# EAGLE schematic MAX30208_HSP3_DEMO_B (EAGLE 6.0)
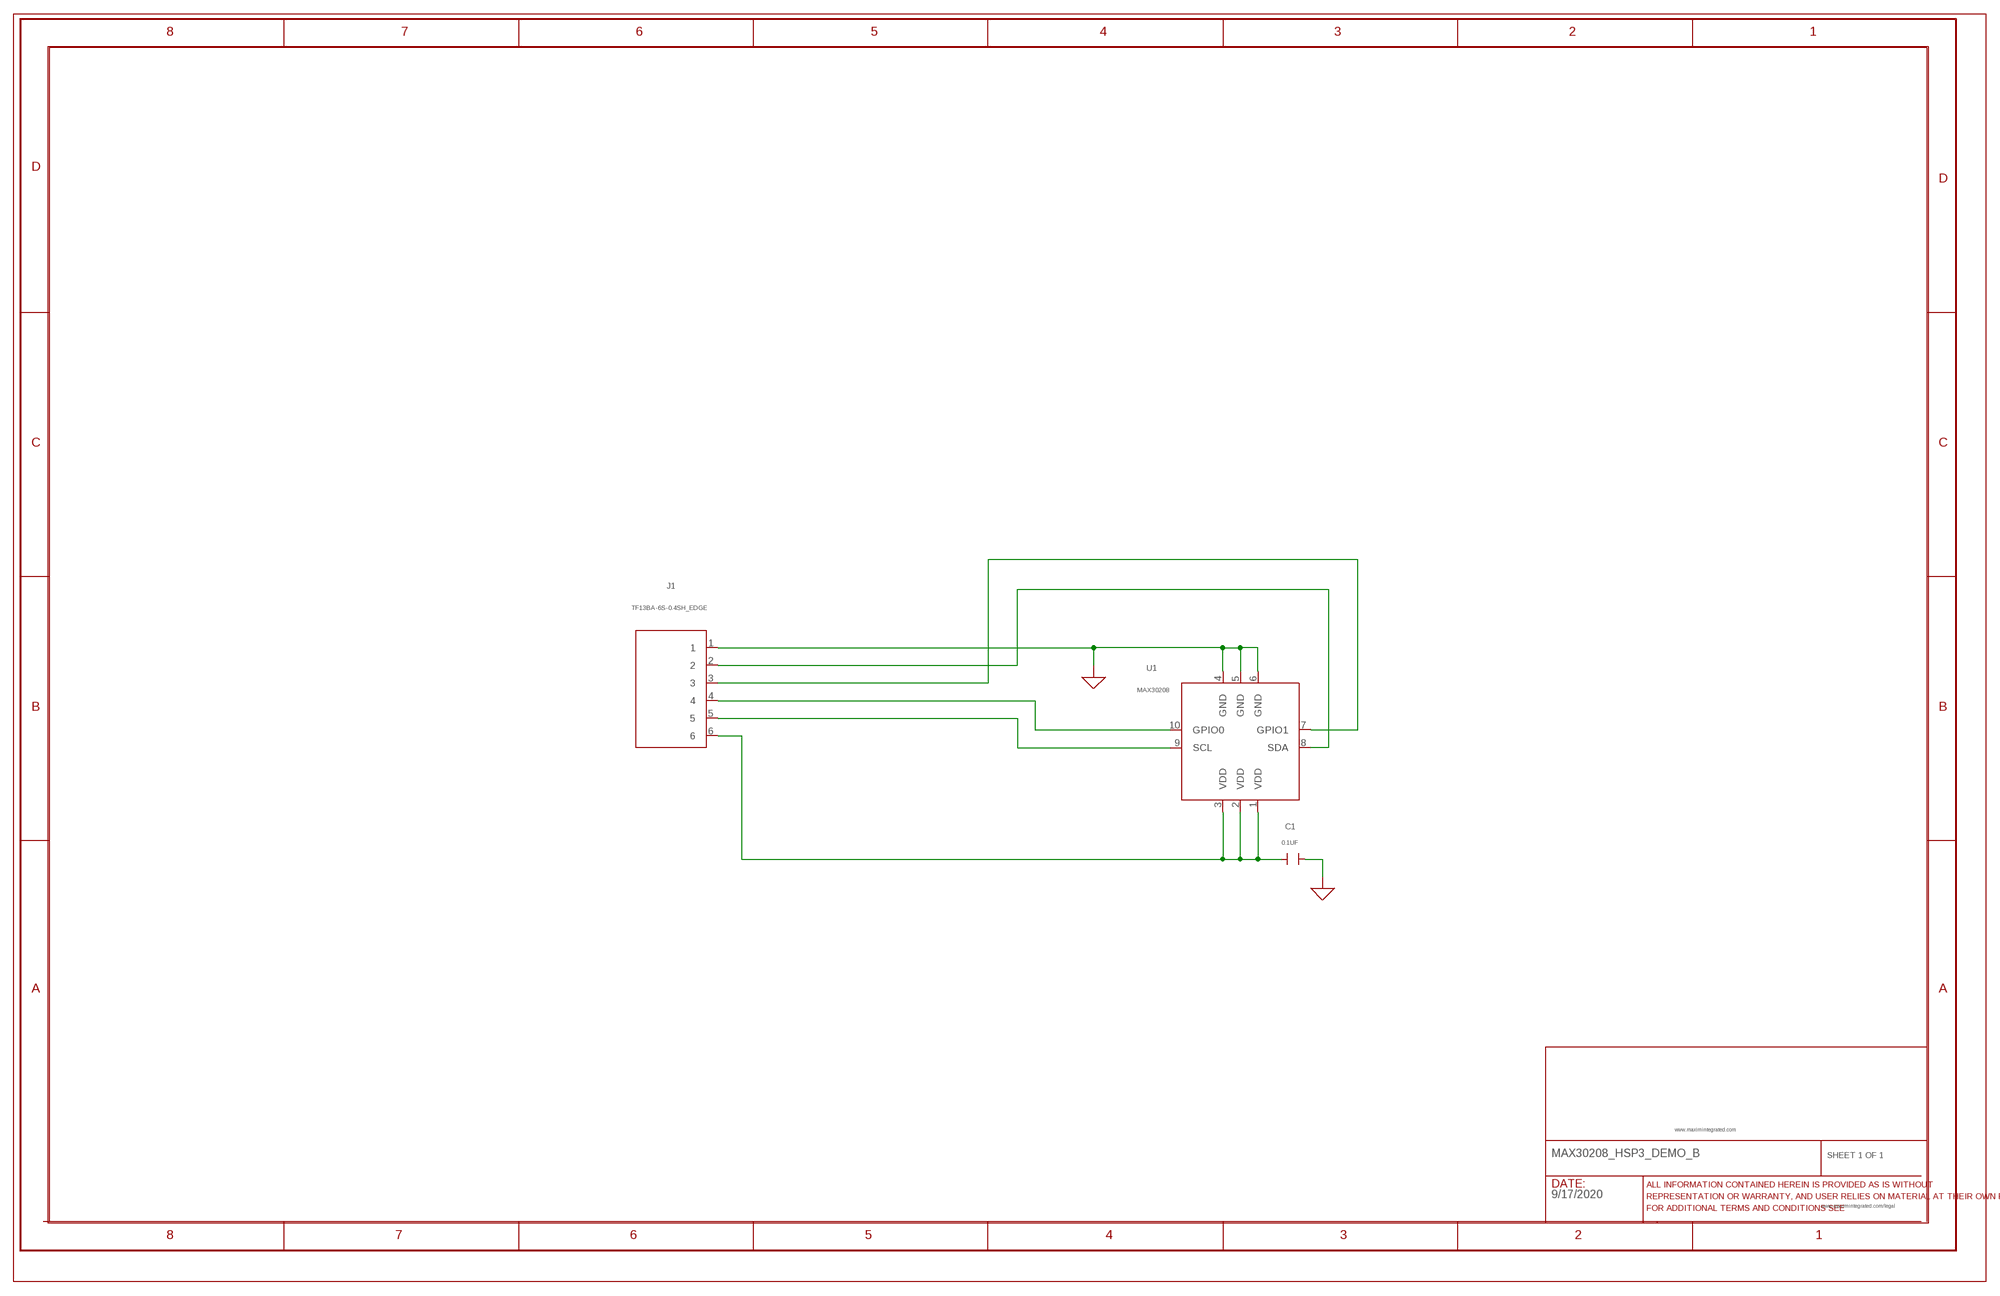
[diagram p0: schematic, sheet 1]
MAXIM_B_SIZE_CF_sym_1_INST_0 (MAXIM_B_SIZE_CF): COMMENT_BODY: TRUE; CUSTOM_TXT_CDS21: SHEET 1 OF 1; Color: Default; DATE_TXT_CDS: 9/17/2020; Design_Create_Date: Monday, April 19, 2021; Design_Create_Time: 17:02:09; Design_File_Name: C:\TEST\ELGRIS\CHDL2EAGLE\MAXIM\MAX30208\MAX30208_HSP3_DEMO_B.DSN; Design_Modify_Date: Tuesday, April 20, 2021; Design_Modify_Time: 16:30:22; Design_Name: C:\TEST\ELGRIS\CHDL2EAGLE\MAXIM\MAX30208\MAX30208_HSP3_DEMO_B.DSN; LEGAL_WEBLINK_TXT_CDS: www.maximintegrated.com/legal; Location_X-Coordinate: 5; Location_Y-Coordinate: 4; OriginalSymbolOrigin: (175,5230); PROJECT_TITLE_TXT_CDS: MAX30208_HSP3_DEMO_B; Page_Create_Date: Monday, April 19, 2021; Page_Create_Time: 17:02:12; Page_Modify_Date: Tuesday, April 20, 2021; Page_Modify_Time: 16:30:22; Page_Number: 1; Page_Size: Custom; Schematic_Create_Date: Monday, April 19, 2021; Schematic_Create_Time: 10:02:14; Schematic_Modify_Date: Tuesday, April 20, 2021; Schematic_Modify_Time: 09:30:24; Schematic_Name: MAX30208_HSP3_DEMO_B; Schematic_Page_Count: 1; Schematic_Page_Number: 1; Source_Library: D:\MAXIM\CHDL2EAGLE\19APR21\MAXREFDES104\MAX30208_HSP3_DEMO_B\1\MML.OLB; Source_Symbol: MAXIM_B_SIZE_CF; WEBLINK1_TXT_CDS: www.maximintegrated.com

## Parts
C1  0.1UF  CAP_NP  [CAPC0603X33M]
J1  TF13BA-6S-0.4SH_EDGE  TF13BA-6S  [HRSC_TF13BA-6S-0_4SH_EDGE]
U1  MAX30208  EK_MAX30208  [MAX_90-100101_1-10]

## Nets
GND_SIGNAL: C1.2 J1.1 U1.4(GND) U1.5(GND) U1.6(GND)
N00033: C1.1 J1.6 U1.1(VDD) U1.2(VDD) U1.3(VDD)
N00051: J1.4 U1.10(GPIO0)
N00057: J1.3 U1.7(GPIO1)
N00067: J1.2 U1.8(SDA)
N00077: J1.5 U1.9(SCL)

## Library data of the parts
C1 = MML:CAP_NP; CAP: 1.00E-07; CASE: SMT (0201); DESCRIPTION: CAP: SMT (0201): 0.1UF: 10%: 25V: X6S: CERAMIC; MANUFACTURER: MURATA; MATERIAL_TYPE: CERAMIC CHIP; MAXINV: 20-000U1-DA39; MFG_PART_NUMBER: GRM033C81E104KE14; OriginalSymbolOrigin: (-50,50); PACK_TYPE: 0201CAPM; PHYS_PAGE: 1; REFLOW: -; TEMP_RANGE: -55 DEGC TO +105 DEGC; TOLERANCE: 10%; VER: 1; VLOG_PARAM01: CAP:INTEGER; VOLTAGE_RATING: 25V
J1 = MML:TF13BA-6S; DESCRIPTION: CONNECTOR: MALE: SMT: TF13BA SERIES: FPC/FFC CONNECTOR: 6PINS: NOTE: EDGE CONNECTOR TO BE USED AT THE END OF A FLEX BOARD; MANUFACTURER: HIROSE ELECTRIC CO LTD; MAXINV: N/A; MFG_PART_NUMBER: TF13BA-6S-0.4SH_EDGE; OriginalSymbolOrigin: (-150,275); PACK_TYPE: SMD_EDGE; PHYS_PAGE: 1; REFLOW: -; TEMP_RANGE: N/A; TOLERANCE: N/A; VER: 1; VOLTAGE_RATING: N/A
U1 = EVKIT_NONCOMPLIANT:EK_MAX30208; DESCRIPTION: EVKIT PART - IC: MAX30208: PACKAGE OUTLINE DRAWING: 21-100265: LGA10; MANUFACTURER: MAXIM; MAXINV: N/A; MFG_PART_NUMBER: MAX30208; OriginalSymbolOrigin: (-325,300); PACK_TYPE: LGA10; PHYS_PAGE: 1; REFLOW: -; SEC_TYPE: LGA10; TEMP_RANGE: N/A; TOLERANCE: N/A; VER: 1; VOLTAGE_RATING: N/A